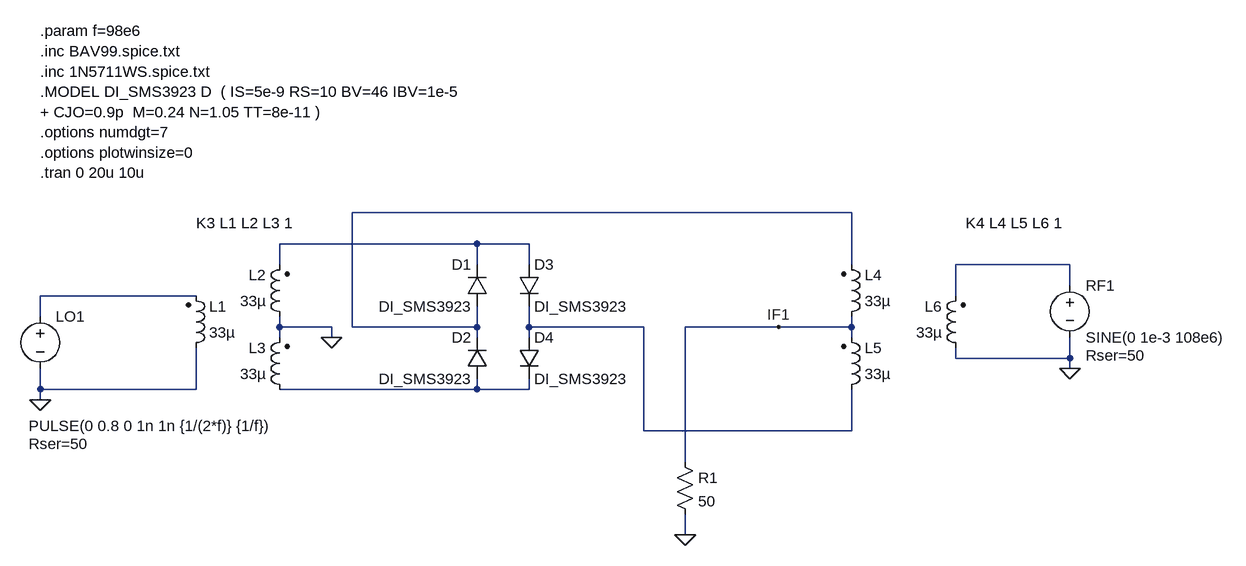
[diagram p0: schematic eth_trafo0.asc]
eth_trafo0.asc, the LTspice schematic file:
Version 4.1
SHEET 1 1124 680
WIRE 528 80 -240 80
WIRE -48 128 -352 128
WIRE 32 128 -48 128
WIRE -352 160 -352 128
WIRE -48 160 -48 128
WIRE 32 160 32 128
WIRE 528 160 528 80
WIRE 864 160 688 160
WIRE 864 192 864 160
WIRE -480 208 -720 208
WIRE 688 208 688 160
WIRE -720 240 -720 208
WIRE -352 256 -352 240
WIRE -272 256 -352 256
WIRE -240 256 -240 80
WIRE -48 256 -48 224
WIRE -48 256 -240 256
WIRE 32 256 32 224
WIRE 208 256 32 256
WIRE 416 256 272 256
WIRE 528 256 528 240
WIRE 528 256 416 256
WIRE -352 272 -352 256
WIRE -272 272 -272 256
WIRE -48 272 -48 256
WIRE 32 272 32 256
WIRE 528 272 528 256
WIRE 688 304 688 288
WIRE 864 304 864 272
WIRE 864 304 688 304
WIRE 864 320 864 304
WIRE -720 352 -720 320
WIRE -480 352 -480 288
WIRE -480 352 -720 352
WIRE -48 352 -48 336
WIRE -48 352 -352 352
WIRE 32 352 32 336
WIRE 32 352 -48 352
WIRE -720 368 -720 352
WIRE 208 416 208 256
WIRE 528 416 528 352
WIRE 528 416 208 416
WIRE 272 464 272 256
WIRE 272 576 272 544
FLAG -272 272 0
FLAG -720 368 0
FLAG 864 320 0
FLAG 272 576 0
FLAG 416 256 IF1
DATAFLAG -624 208 ""
SYMBOL voltage -720 224 R0
WINDOW 3 -18 184 Left 2
WINDOW 123 0 0 Left 0
WINDOW 39 -18 212 Left 2
SYMATTR Value PULSE(0 0.8 0 1n 1n {1/(2*f)} {1/f})
SYMATTR SpiceLine Rser=50
SYMATTR InstName LO1
SYMBOL ind2 -496 304 M180
WINDOW 0 36 80 Left 2
WINDOW 3 36 40 Left 2
SYMATTR InstName L1
SYMATTR Value 33µ
SYMATTR Type ind
SYMBOL ind2 -336 256 R180
WINDOW 0 36 80 Left 2
WINDOW 3 36 40 Left 2
SYMATTR InstName L2
SYMATTR Value 33µ
SYMATTR Type ind
SYMBOL ind2 -336 368 R180
WINDOW 0 36 80 Left 2
WINDOW 3 36 40 Left 2
SYMATTR InstName L3
SYMATTR Value 33µ
SYMATTR Type ind
SYMBOL ind2 512 256 M180
WINDOW 0 36 80 Left 2
WINDOW 3 36 40 Left 2
SYMATTR InstName L4
SYMATTR Value 33µ
SYMATTR Type ind
SYMBOL ind2 512 368 M180
WINDOW 0 36 80 Left 2
WINDOW 3 36 40 Left 2
SYMATTR InstName L5
SYMATTR Value 33µ
SYMATTR Type ind
SYMBOL ind2 704 304 R180
WINDOW 0 36 80 Left 2
WINDOW 3 36 40 Left 2
SYMATTR InstName L6
SYMATTR Value 33µ
SYMATTR Type ind
SYMBOL voltage 864 176 R0
WINDOW 123 0 0 Left 0
WINDOW 39 24 124 Left 2
SYMATTR SpiceLine Rser=50
SYMATTR InstName RF1
SYMATTR Value SINE(0 1e-3 108e6)
SYMBOL res 256 448 R0
SYMATTR InstName R1
SYMATTR Value 50
SYMBOL diode -32 224 R180
WINDOW 0 24 64 Left 2
WINDOW 3 24 0 Left 2
SYMATTR InstName D1
SYMATTR Value DI_SMS3923
SYMBOL diode -32 336 R180
WINDOW 0 24 64 Left 2
WINDOW 3 24 0 Left 2
SYMATTR InstName D2
SYMATTR Value DI_SMS3923
SYMBOL diode 16 160 R0
SYMATTR InstName D3
SYMATTR Value DI_SMS3923
SYMBOL diode 16 272 R0
SYMATTR InstName D4
SYMATTR Value DI_SMS3923
TEXT -480 96 Left 2 !K3 L1 L2 L3 1
TEXT 704 96 Left 2 !K4 L4 L5 L6 1
TEXT -720 -200 Left 2 !.param f=98e6\n.inc BAV99.spice.txt\n.inc 1N5711WS.spice.txt\n.MODEL DI_SMS3923 D  ( IS=5e-9 RS=10 BV=46 IBV=1e-5\n+ CJO=0.9p  M=0.24 N=1.05 TT=8e-11 )\n.options numdgt=7\n.options plotwinsize=0\n.tran 0 20u 10u

The netlist it stands for:
* eth_trafo0.asc
V§LO1 N004 0 PULSE(0 0.8 0 1n 1n {1/(2*f)} {1/f}) Rser=50
L1 0 N004 33µ
L2 0 N002 33µ
L3 N006 0 33µ
L4 IF1 N001 33µ
L5 N005 IF1 33µ
L6 0 N003 33µ
V§RF1 N003 0 SINE(0 1e-3 108e6) Rser=50
R1 IF1 0 50
D1 N001 N002 DI_SMS3923
D2 N006 N001 DI_SMS3923
D3 N002 N005 DI_SMS3923
D4 N005 N006 DI_SMS3923
.model D D
.lib standard.dio
K3 L1 L2 L3 1
K4 L4 L5 L6 1
.param f=98e6
.inc BAV99.spice.txt
.inc 1N5711WS.spice.txt
.MODEL DI_SMS3923 D  ( IS=5e-9 RS=10 BV=46 IBV=1e-5
+ CJO=0.9p  M=0.24 N=1.05 TT=8e-11 )
.options numdgt=7
.options plotwinsize=0
.tran 0 20u 10u
.backanno
.end